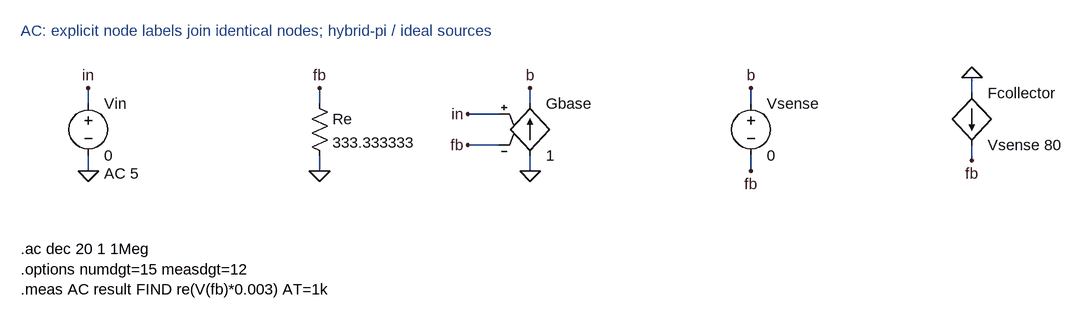
[diagram p0: schematic AC.asc]
AC.asc, the LTspice schematic file:
Version 4
SHEET 1 1800 1500
TEXT 16 -48 Left 2 ;AC: explicit node labels join identical nodes; hybrid-pi / ideal sources
WIRE 120 64 120 40
FLAG 120 40 in
WIRE 120 144 120 168
FLAG 120 168 0
SYMBOL voltage 120 48 R0
SYMATTR InstName Vin
WINDOW 123 24 124 Left 2
SYMATTR Value 0
SYMATTR Value2 AC 5
WIRE 476 64 476 40
FLAG 476 40 fb
WIRE 476 144 476 168
FLAG 476 168 0
SYMBOL res 460 48 R0
SYMATTR InstName Re
SYMATTR Value 333.333333
WIRE 800 144 800 168
FLAG 800 168 0
WIRE 800 64 800 40
FLAG 800 40 b
WIRE 752 80 704 80
FLAG 704 80 in
WIRE 752 128 704 128
FLAG 704 128 fb
SYMBOL g 800 48 R0
SYMATTR InstName Gbase
SYMATTR Value 1
WIRE 1140 64 1140 40
FLAG 1140 40 b
WIRE 1140 144 1140 168
FLAG 1140 168 fb
SYMBOL voltage 1140 48 R0
SYMATTR InstName Vsense
SYMATTR Value 0
WIRE 1480 48 1480 24
FLAG 1480 24 0
WIRE 1480 128 1480 152
FLAG 1480 152 fb
SYMBOL f 1480 48 R0
SYMATTR InstName Fcollector
SYMATTR Value Vsense 80
TEXT 16 288 Left 2 !.ac dec 20 1 1Meg\n.options numdgt=15 measdgt=12\n.meas AC result FIND re(V(fb)*0.003) AT=1k

The netlist it stands for:
* AC.asc
Vin in 0 0 AC 5
Re fb 0 333.333333
Gbase 0 b in fb 1
Vsense b fb 0
Fcollector 0 fb Vsense 80
* AC: explicit node labels join identical nodes; hybrid-pi / ideal sources
.ac dec 20 1 1Meg
.options numdgt=15 measdgt=12
.meas AC result FIND re(V(fb)*0.003) AT=1k
.backanno
.end

* Results of the author's LTspice run, read from the files saved beside the schematic
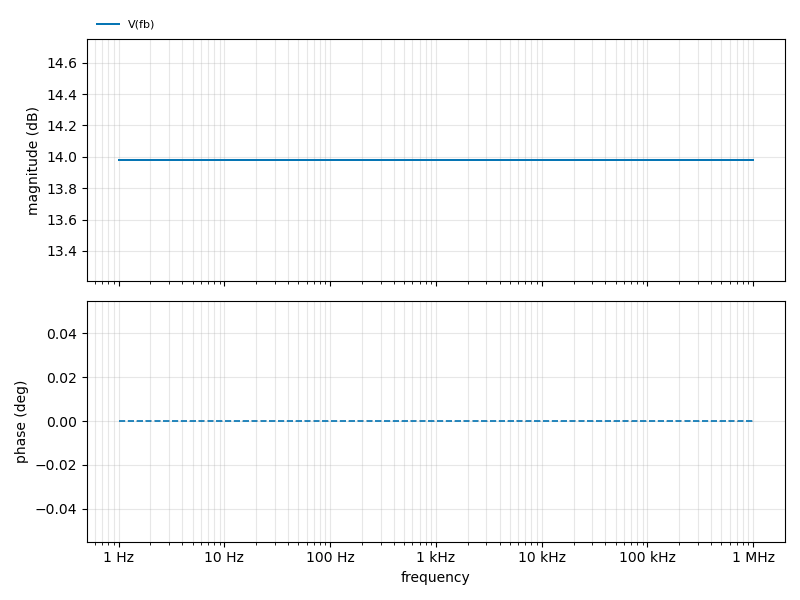
[diagram p1: AC Analysis of AC.asc, plotted from the saved traces]
* AC Analysis, 1 run:
*   V(fb): 13.98 dB at 1 Hz, 13.98 dB at 1 MHz, peak 13.98 dB at 1 Hz
* From the log:
*   result: re(V(fb)*0.003)=(-36.4784965125dB,0°) at 1000